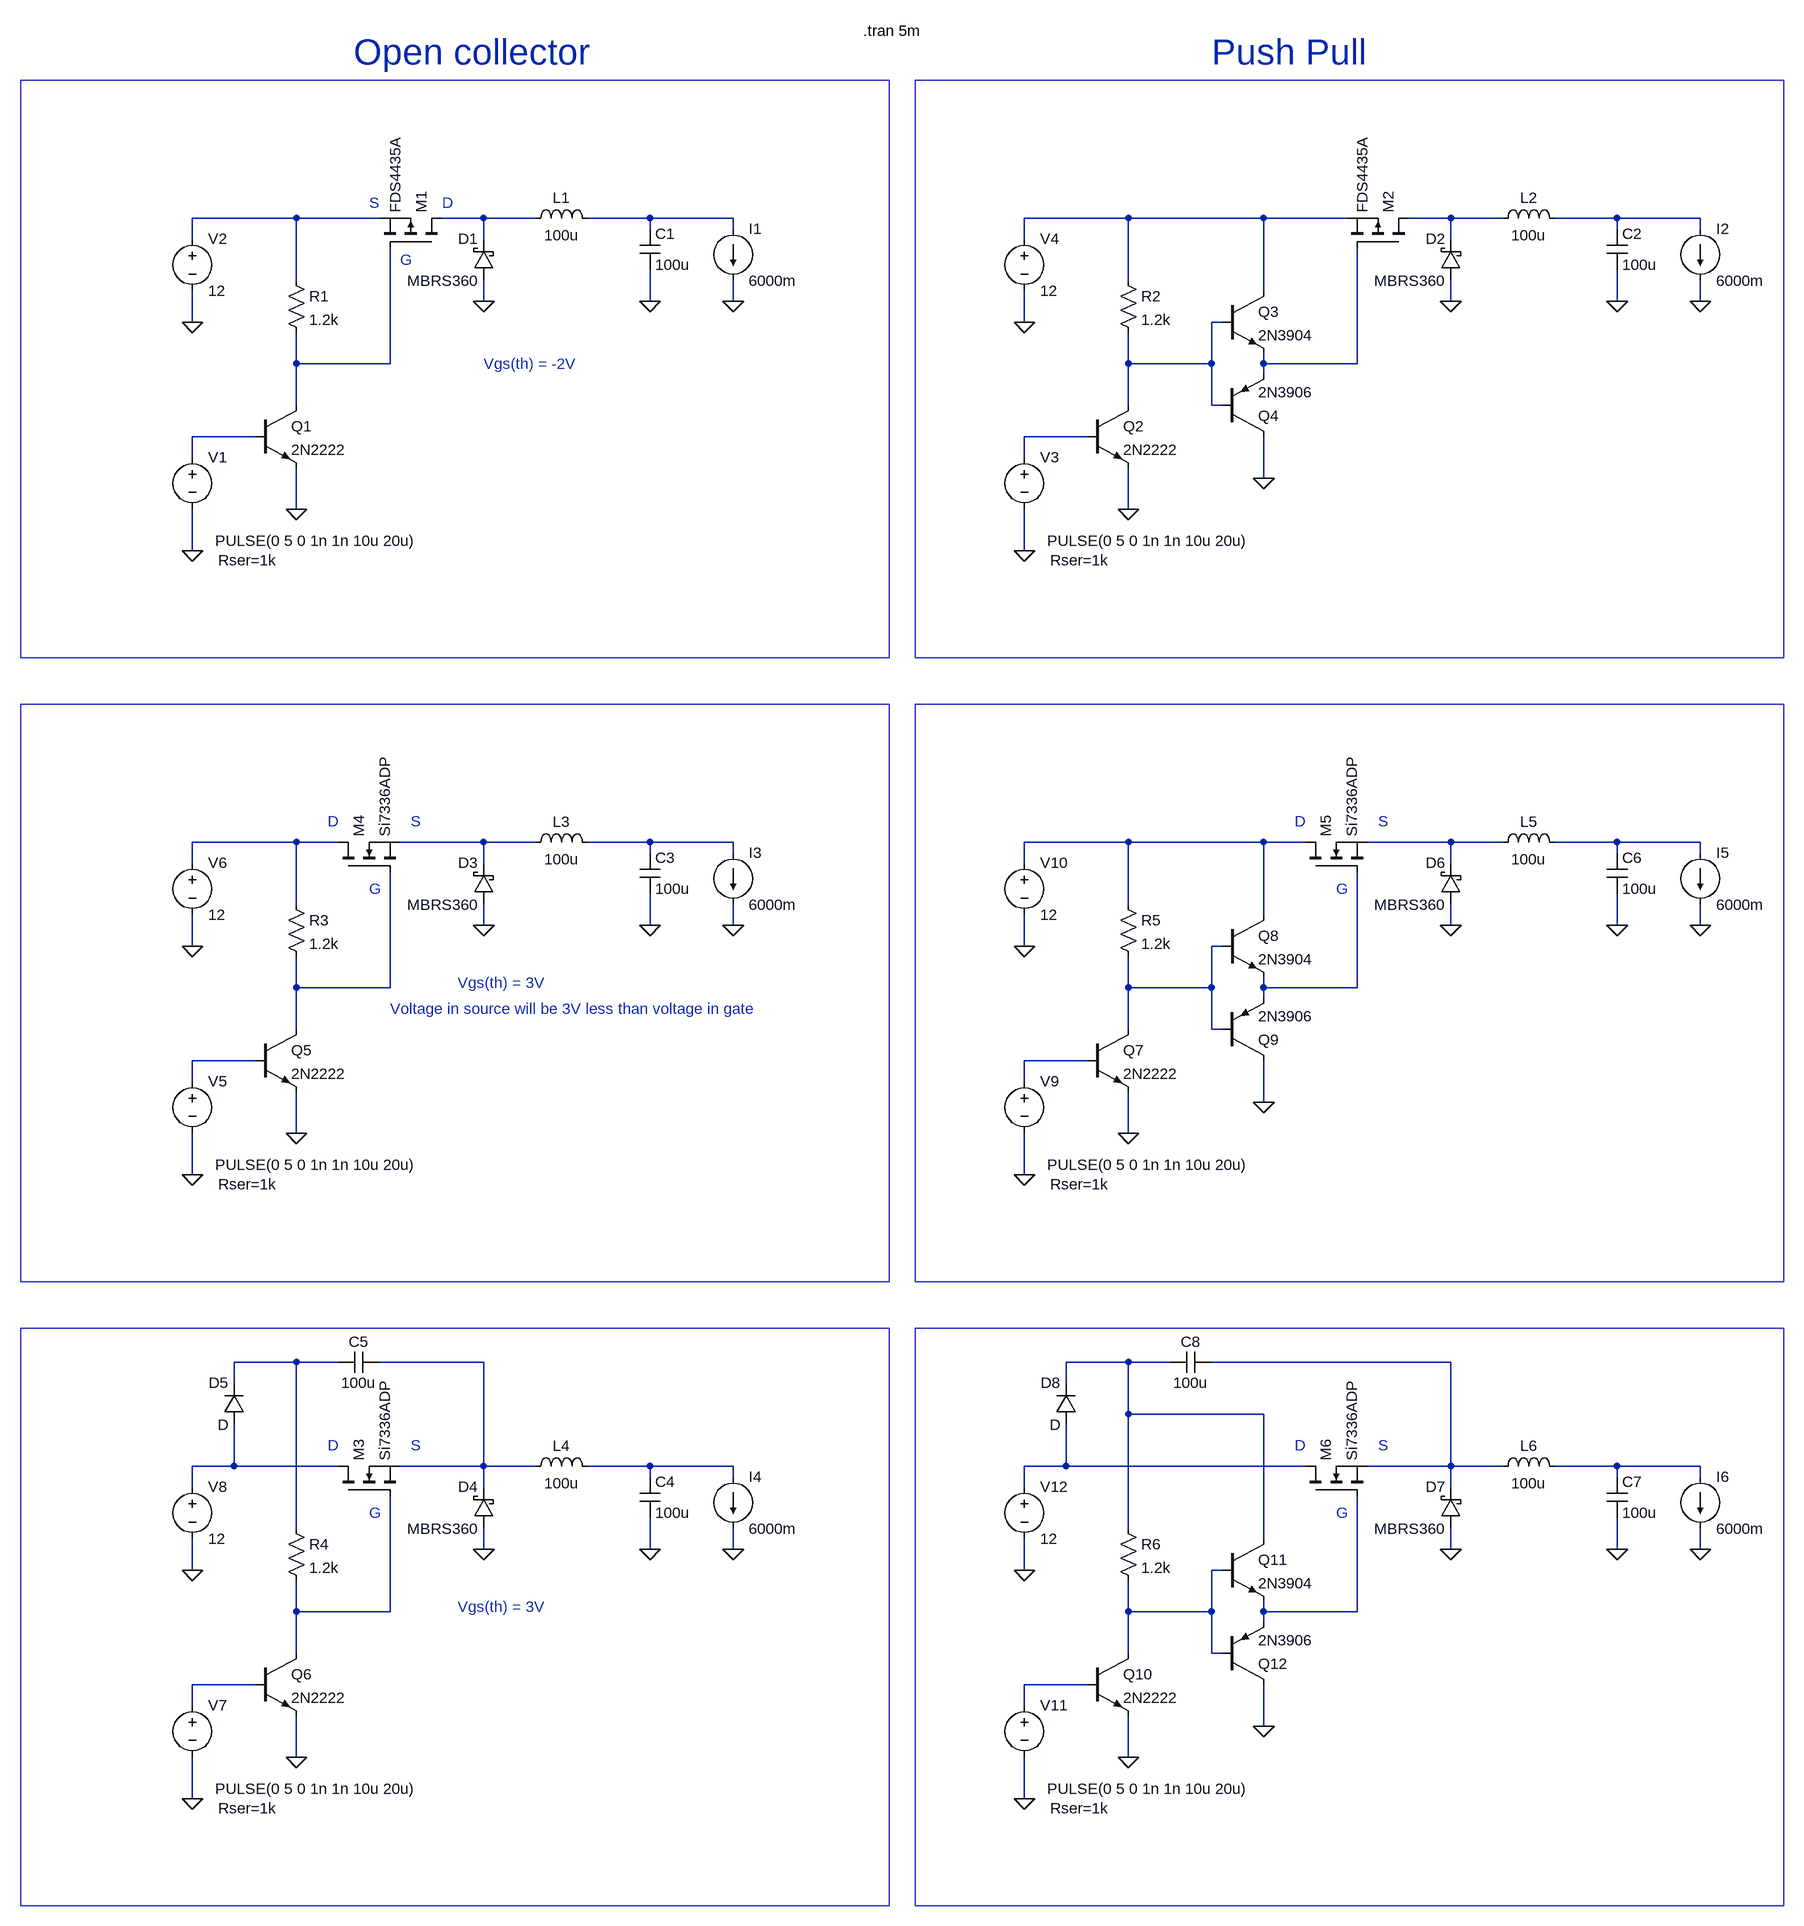
[diagram p0: schematic bulk-converters.asc]
bulk-converters.asc, the LTspice schematic file:
Version 4
SHEET 1 2732 2728
WIRE 320 128 160 128
WIRE 448 128 320 128
WIRE 608 128 544 128
WIRE 688 128 608 128
WIRE 864 128 768 128
WIRE 992 128 864 128
WIRE 1600 128 1440 128
WIRE 1808 128 1600 128
WIRE 1936 128 1808 128
WIRE 2096 128 2032 128
WIRE 2176 128 2096 128
WIRE 2352 128 2256 128
WIRE 2480 128 2352 128
WIRE 864 144 864 128
WIRE 992 144 992 128
WIRE 2352 144 2352 128
WIRE 2480 144 2480 128
WIRE 160 160 160 128
WIRE 608 160 608 128
WIRE 1440 160 1440 128
WIRE 2096 160 2096 128
WIRE 320 224 320 128
WIRE 1600 224 1600 128
WIRE 1808 240 1808 128
WIRE 608 256 608 224
WIRE 864 256 864 208
WIRE 992 256 992 224
WIRE 2096 256 2096 224
WIRE 2352 256 2352 208
WIRE 2480 256 2480 224
WIRE 160 288 160 240
WIRE 1440 288 1440 240
WIRE 1744 288 1728 288
WIRE 320 352 320 304
WIRE 464 352 464 176
WIRE 464 352 320 352
WIRE 1600 352 1600 304
WIRE 1728 352 1728 288
WIRE 1728 352 1600 352
WIRE 1808 352 1808 336
WIRE 1952 352 1952 176
WIRE 1952 352 1808 352
WIRE 1808 368 1808 352
WIRE 320 416 320 352
WIRE 1600 416 1600 352
WIRE 1728 416 1728 352
WIRE 1744 416 1728 416
WIRE 256 464 160 464
WIRE 1536 464 1440 464
WIRE 160 496 160 464
WIRE 1440 496 1440 464
WIRE 1808 528 1808 464
WIRE 320 576 320 512
WIRE 1600 576 1600 512
WIRE 160 640 160 576
WIRE 1440 640 1440 576
WIRE 320 1088 160 1088
WIRE 384 1088 320 1088
WIRE 608 1088 480 1088
WIRE 688 1088 608 1088
WIRE 864 1088 768 1088
WIRE 992 1088 864 1088
WIRE 1600 1088 1440 1088
WIRE 1808 1088 1600 1088
WIRE 1872 1088 1808 1088
WIRE 2096 1088 1968 1088
WIRE 2176 1088 2096 1088
WIRE 2352 1088 2256 1088
WIRE 2480 1088 2352 1088
WIRE 864 1104 864 1088
WIRE 992 1104 992 1088
WIRE 2352 1104 2352 1088
WIRE 2480 1104 2480 1088
WIRE 160 1120 160 1088
WIRE 608 1120 608 1088
WIRE 1440 1120 1440 1088
WIRE 2096 1120 2096 1088
WIRE 320 1184 320 1088
WIRE 1600 1184 1600 1088
WIRE 1808 1200 1808 1088
WIRE 608 1216 608 1184
WIRE 864 1216 864 1168
WIRE 992 1216 992 1184
WIRE 2096 1216 2096 1184
WIRE 2352 1216 2352 1168
WIRE 2480 1216 2480 1184
WIRE 160 1248 160 1200
WIRE 1440 1248 1440 1200
WIRE 1744 1248 1728 1248
WIRE 320 1312 320 1264
WIRE 464 1312 464 1136
WIRE 464 1312 320 1312
WIRE 1600 1312 1600 1264
WIRE 1728 1312 1728 1248
WIRE 1728 1312 1600 1312
WIRE 1808 1312 1808 1296
WIRE 1952 1312 1952 1136
WIRE 1952 1312 1808 1312
WIRE 1808 1328 1808 1312
WIRE 320 1376 320 1312
WIRE 1600 1376 1600 1312
WIRE 1728 1376 1728 1312
WIRE 1744 1376 1728 1376
WIRE 256 1424 160 1424
WIRE 1536 1424 1440 1424
WIRE 160 1456 160 1424
WIRE 1440 1456 1440 1424
WIRE 1808 1488 1808 1424
WIRE 320 1536 320 1472
WIRE 1600 1536 1600 1472
WIRE 160 1600 160 1536
WIRE 1440 1600 1440 1536
WIRE 320 1888 224 1888
WIRE 384 1888 320 1888
WIRE 608 1888 448 1888
WIRE 1600 1888 1504 1888
WIRE 1664 1888 1600 1888
WIRE 2096 1888 1728 1888
WIRE 224 1920 224 1888
WIRE 1504 1920 1504 1888
WIRE 1600 1968 1600 1888
WIRE 1808 1968 1600 1968
WIRE 224 2048 224 1984
WIRE 224 2048 160 2048
WIRE 384 2048 224 2048
WIRE 608 2048 608 1888
WIRE 608 2048 480 2048
WIRE 688 2048 608 2048
WIRE 864 2048 768 2048
WIRE 992 2048 864 2048
WIRE 1504 2048 1504 1984
WIRE 1504 2048 1440 2048
WIRE 1872 2048 1504 2048
WIRE 2096 2048 2096 1888
WIRE 2096 2048 1968 2048
WIRE 2176 2048 2096 2048
WIRE 2352 2048 2256 2048
WIRE 2480 2048 2352 2048
WIRE 864 2064 864 2048
WIRE 992 2064 992 2048
WIRE 2352 2064 2352 2048
WIRE 2480 2064 2480 2048
WIRE 160 2080 160 2048
WIRE 608 2080 608 2048
WIRE 1440 2080 1440 2048
WIRE 2096 2080 2096 2048
WIRE 320 2144 320 1888
WIRE 1600 2144 1600 1968
WIRE 1808 2160 1808 1968
WIRE 608 2176 608 2144
WIRE 864 2176 864 2128
WIRE 992 2176 992 2144
WIRE 2096 2176 2096 2144
WIRE 2352 2176 2352 2128
WIRE 2480 2176 2480 2144
WIRE 160 2208 160 2160
WIRE 1440 2208 1440 2160
WIRE 1744 2208 1728 2208
WIRE 320 2272 320 2224
WIRE 464 2272 464 2096
WIRE 464 2272 320 2272
WIRE 1600 2272 1600 2224
WIRE 1728 2272 1728 2208
WIRE 1728 2272 1600 2272
WIRE 1808 2272 1808 2256
WIRE 1952 2272 1952 2096
WIRE 1952 2272 1808 2272
WIRE 1808 2288 1808 2272
WIRE 320 2336 320 2272
WIRE 1600 2336 1600 2272
WIRE 1728 2336 1728 2272
WIRE 1744 2336 1728 2336
WIRE 256 2384 160 2384
WIRE 1536 2384 1440 2384
WIRE 160 2416 160 2384
WIRE 1440 2416 1440 2384
WIRE 1808 2448 1808 2384
WIRE 320 2496 320 2432
WIRE 1600 2496 1600 2432
WIRE 160 2560 160 2496
WIRE 1440 2560 1440 2496
FLAG 864 256 0
FLAG 992 256 0
FLAG 608 256 0
FLAG 320 576 0
FLAG 160 640 0
FLAG 160 288 0
FLAG 2352 256 0
FLAG 2480 256 0
FLAG 2096 256 0
FLAG 1808 528 0
FLAG 1440 640 0
FLAG 1440 288 0
FLAG 1600 576 0
FLAG 864 1216 0
FLAG 992 1216 0
FLAG 608 1216 0
FLAG 320 1536 0
FLAG 160 1600 0
FLAG 160 1248 0
FLAG 864 2176 0
FLAG 992 2176 0
FLAG 608 2176 0
FLAG 320 2496 0
FLAG 160 2560 0
FLAG 160 2208 0
FLAG 2352 1216 0
FLAG 2480 1216 0
FLAG 2096 1216 0
FLAG 1808 1488 0
FLAG 1440 1600 0
FLAG 1440 1248 0
FLAG 1600 1536 0
FLAG 2352 2176 0
FLAG 2480 2176 0
FLAG 2096 2176 0
FLAG 1808 2448 0
FLAG 1440 2560 0
FLAG 1440 2208 0
FLAG 1600 2496 0
SYMBOL npn 256 416 R0
SYMATTR InstName Q1
SYMATTR Value 2N2222
SYMBOL voltage 160 480 R0
WINDOW 3 35 144 Left 2
WINDOW 39 40 174 Left 2
SYMATTR Value PULSE(0 5 0 1n 1n 10u 20u)
SYMATTR SpiceLine Rser=1k
SYMATTR InstName V1
SYMBOL voltage 160 144 R0
SYMATTR InstName V2
SYMATTR Value 12
SYMBOL res 304 208 R0
SYMATTR InstName R1
SYMATTR Value 1.2k
SYMBOL pmos 544 176 M270
SYMATTR InstName M1
SYMATTR Value FDS4435A
SYMBOL ind 784 144 M270
WINDOW 0 32 56 VTop 2
WINDOW 3 5 56 VBottom 2
SYMATTR InstName L1
SYMATTR Value 100u
SYMBOL cap 848 144 R0
SYMATTR InstName C1
SYMATTR Value 100u
SYMBOL current 992 144 R0
SYMATTR InstName I1
SYMATTR Value 6000m
SYMBOL schottky 624 224 R180
WINDOW 0 24 64 Left 2
WINDOW 3 24 0 Left 2
SYMATTR InstName D1
SYMATTR Value MBRS360
SYMBOL npn 1536 416 R0
SYMATTR InstName Q2
SYMATTR Value 2N2222
SYMBOL voltage 1440 480 R0
WINDOW 3 35 144 Left 2
WINDOW 39 40 174 Left 2
SYMATTR Value PULSE(0 5 0 1n 1n 10u 20u)
SYMATTR SpiceLine Rser=1k
SYMATTR InstName V3
SYMBOL voltage 1440 144 R0
SYMATTR InstName V4
SYMATTR Value 12
SYMBOL res 1584 208 R0
SYMATTR InstName R2
SYMATTR Value 1.2k
SYMBOL pmos 2032 176 M270
SYMATTR InstName M2
SYMATTR Value FDS4435A
SYMBOL ind 2272 144 M270
WINDOW 0 32 56 VTop 2
WINDOW 3 5 56 VBottom 2
SYMATTR InstName L2
SYMATTR Value 100u
SYMBOL cap 2336 144 R0
SYMATTR InstName C2
SYMATTR Value 100u
SYMBOL current 2480 144 R0
SYMATTR InstName I2
SYMATTR Value 6000m
SYMBOL schottky 2112 224 R180
WINDOW 0 24 64 Left 2
WINDOW 3 24 0 Left 2
SYMATTR InstName D2
SYMATTR Value MBRS360
SYMBOL npn 1744 240 R0
SYMATTR InstName Q3
SYMATTR Value 2N3904
SYMBOL pnp 1744 464 M180
SYMATTR InstName Q4
SYMATTR Value 2N3906
SYMBOL npn 256 1376 R0
SYMATTR InstName Q5
SYMATTR Value 2N2222
SYMBOL voltage 160 1440 R0
WINDOW 3 35 144 Left 2
WINDOW 39 40 174 Left 2
SYMATTR Value PULSE(0 5 0 1n 1n 10u 20u)
SYMATTR SpiceLine Rser=1k
SYMATTR InstName V5
SYMBOL voltage 160 1104 R0
SYMATTR InstName V6
SYMATTR Value 12
SYMBOL res 304 1168 R0
SYMATTR InstName R3
SYMATTR Value 1.2k
SYMBOL ind 784 1104 M270
WINDOW 0 32 56 VTop 2
WINDOW 3 5 56 VBottom 2
SYMATTR InstName L3
SYMATTR Value 100u
SYMBOL cap 848 1104 R0
SYMATTR InstName C3
SYMATTR Value 100u
SYMBOL current 992 1104 R0
SYMATTR InstName I3
SYMATTR Value 6000m
SYMBOL schottky 624 1184 R180
WINDOW 0 24 64 Left 2
WINDOW 3 24 0 Left 2
SYMATTR InstName D3
SYMATTR Value MBRS360
SYMBOL nmos 384 1136 R270
SYMATTR InstName M4
SYMATTR Value Si7336ADP
SYMBOL npn 256 2336 R0
SYMATTR InstName Q6
SYMATTR Value 2N2222
SYMBOL voltage 160 2400 R0
WINDOW 3 35 144 Left 2
WINDOW 39 40 174 Left 2
SYMATTR Value PULSE(0 5 0 1n 1n 10u 20u)
SYMATTR SpiceLine Rser=1k
SYMATTR InstName V7
SYMBOL voltage 160 2064 R0
SYMATTR InstName V8
SYMATTR Value 12
SYMBOL res 304 2128 R0
SYMATTR InstName R4
SYMATTR Value 1.2k
SYMBOL ind 784 2064 M270
WINDOW 0 32 56 VTop 2
WINDOW 3 5 56 VBottom 2
SYMATTR InstName L4
SYMATTR Value 100u
SYMBOL cap 848 2064 R0
SYMATTR InstName C4
SYMATTR Value 100u
SYMBOL current 992 2064 R0
SYMATTR InstName I4
SYMATTR Value 6000m
SYMBOL schottky 624 2144 R180
WINDOW 0 24 64 Left 2
WINDOW 3 24 0 Left 2
SYMATTR InstName D4
SYMATTR Value MBRS360
SYMBOL nmos 384 2096 R270
SYMATTR InstName M3
SYMATTR Value Si7336ADP
SYMBOL diode 240 1984 R180
WINDOW 0 24 64 Left 2
WINDOW 3 24 0 Left 2
SYMATTR InstName D5
SYMBOL cap 448 1872 R90
WINDOW 0 0 32 VBottom 2
WINDOW 3 32 32 VTop 2
SYMATTR InstName C5
SYMATTR Value 100u
SYMBOL npn 1536 1376 R0
SYMATTR InstName Q7
SYMATTR Value 2N2222
SYMBOL voltage 1440 1440 R0
WINDOW 3 35 144 Left 2
WINDOW 39 40 174 Left 2
SYMATTR Value PULSE(0 5 0 1n 1n 10u 20u)
SYMATTR SpiceLine Rser=1k
SYMATTR InstName V9
SYMBOL voltage 1440 1104 R0
SYMATTR InstName V10
SYMATTR Value 12
SYMBOL res 1584 1168 R0
SYMATTR InstName R5
SYMATTR Value 1.2k
SYMBOL ind 2272 1104 M270
WINDOW 0 32 56 VTop 2
WINDOW 3 5 56 VBottom 2
SYMATTR InstName L5
SYMATTR Value 100u
SYMBOL cap 2336 1104 R0
SYMATTR InstName C6
SYMATTR Value 100u
SYMBOL current 2480 1104 R0
SYMATTR InstName I5
SYMATTR Value 6000m
SYMBOL schottky 2112 1184 R180
WINDOW 0 24 64 Left 2
WINDOW 3 24 0 Left 2
SYMATTR InstName D6
SYMATTR Value MBRS360
SYMBOL npn 1744 1200 R0
SYMATTR InstName Q8
SYMATTR Value 2N3904
SYMBOL pnp 1744 1424 M180
SYMATTR InstName Q9
SYMATTR Value 2N3906
SYMBOL nmos 1872 1136 R270
SYMATTR InstName M5
SYMATTR Value Si7336ADP
SYMBOL npn 1536 2336 R0
SYMATTR InstName Q10
SYMATTR Value 2N2222
SYMBOL voltage 1440 2400 R0
WINDOW 3 35 144 Left 2
WINDOW 39 40 174 Left 2
SYMATTR Value PULSE(0 5 0 1n 1n 10u 20u)
SYMATTR SpiceLine Rser=1k
SYMATTR InstName V11
SYMBOL voltage 1440 2064 R0
SYMATTR InstName V12
SYMATTR Value 12
SYMBOL res 1584 2128 R0
SYMATTR InstName R6
SYMATTR Value 1.2k
SYMBOL ind 2272 2064 M270
WINDOW 0 32 56 VTop 2
WINDOW 3 5 56 VBottom 2
SYMATTR InstName L6
SYMATTR Value 100u
SYMBOL cap 2336 2064 R0
SYMATTR InstName C7
SYMATTR Value 100u
SYMBOL current 2480 2064 R0
SYMATTR InstName I6
SYMATTR Value 6000m
SYMBOL schottky 2112 2144 R180
WINDOW 0 24 64 Left 2
WINDOW 3 24 0 Left 2
SYMATTR InstName D7
SYMATTR Value MBRS360
SYMBOL npn 1744 2160 R0
SYMATTR InstName Q11
SYMATTR Value 2N3904
SYMBOL pnp 1744 2384 M180
SYMATTR InstName Q12
SYMATTR Value 2N3906
SYMBOL nmos 1872 2096 R270
SYMATTR InstName M6
SYMATTR Value Si7336ADP
SYMBOL diode 1520 1984 R180
WINDOW 0 24 64 Left 2
WINDOW 3 24 0 Left 2
SYMATTR InstName D8
SYMBOL cap 1728 1872 R90
WINDOW 0 0 32 VBottom 2
WINDOW 3 32 32 VTop 2
SYMATTR InstName C8
SYMATTR Value 100u
TEXT 1192 -160 Left 2 !.tran 5m
TEXT 368 1056 Left 2 ;D
TEXT 496 1056 Left 2 ;S
TEXT 432 1160 Left 2 ;G
TEXT 568 1304 Left 2 ;Vgs(th) = 3V
TEXT 464 1344 Left 2 ;Voltage in source will be 3V less than voltage in gate
TEXT 368 2016 Left 2 ;D
TEXT 496 2016 Left 2 ;S
TEXT 432 2120 Left 2 ;G
TEXT 568 2264 Left 2 ;Vgs(th) = 3V
TEXT 1856 1056 Left 2 ;D
TEXT 1984 1056 Left 2 ;S
TEXT 1920 1160 Left 2 ;G
TEXT 1856 2016 Left 2 ;D
TEXT 1984 2016 Left 2 ;S
TEXT 1920 2120 Left 2 ;G
TEXT 608 352 Left 2 ;Vgs(th) = -2V
TEXT 480 192 Left 2 ;G
TEXT 432 104 Left 2 ;S
TEXT 544 104 Left 2 ;D
TEXT 408 -128 Left 5 ;Open collector
TEXT 1728 -128 Left 5 ;Push Pull
RECTANGLE Normal 1272 -84 2608 804
RECTANGLE Normal -104 -84 1232 804
RECTANGLE Normal -104 876 1232 1764
RECTANGLE Normal -104 1836 1232 2724
RECTANGLE Normal 1272 876 2608 1764
RECTANGLE Normal 1272 1836 2608 2724

The netlist it stands for:
* bulk-converters.asc
Q1 N008 N010 0 0 2N2222
V1 N010 0 PULSE(0 5 0 1n 1n 10u 20u) Rser=1k
V2 N001 0 12
R1 N001 N008 1.2k
M1 N002 N008 N001 N001 FDS4435A
L1 N003 N002 100u
C1 N003 0 100u
I1 N003 0 6000m
D1 0 N002 MBRS360
Q2 N007 N011 0 0 2N2222
V3 N011 0 PULSE(0 5 0 1n 1n 10u 20u) Rser=1k
V4 N004 0 12
R2 N004 N007 1.2k
M2 N005 N009 N004 N004 FDS4435A
L2 N006 N005 100u
C2 N006 0 100u
I2 N006 0 6000m
D2 0 N005 MBRS360
Q3 N004 N007 N009 0 2N3904
Q4 0 N007 N009 0 2N3906
Q5 N019 N021 0 0 2N2222
V5 N021 0 PULSE(0 5 0 1n 1n 10u 20u) Rser=1k
V6 N012 0 12
R3 N012 N019 1.2k
L3 N014 N013 100u
C3 N014 0 100u
I3 N014 0 6000m
D3 0 N013 MBRS360
M4 N012 N019 N013 N013 Si7336ADP
Q6 N032 N034 0 0 2N2222
V7 N034 0 PULSE(0 5 0 1n 1n 10u 20u) Rser=1k
V8 N027 0 12
R4 N023 N032 1.2k
L4 N028 N024 100u
C4 N028 0 100u
I4 N028 0 6000m
D4 0 N024 MBRS360
M3 N027 N032 N024 N024 Si7336ADP
D5 N027 N023 D
C5 N024 N023 100u
Q7 N018 N022 0 0 2N2222
V9 N022 0 PULSE(0 5 0 1n 1n 10u 20u) Rser=1k
V10 N015 0 12
R5 N015 N018 1.2k
L5 N017 N016 100u
C6 N017 0 100u
I5 N017 0 6000m
D6 0 N016 MBRS360
Q8 N015 N018 N020 0 2N3904
Q9 0 N018 N020 0 2N3906
M5 N015 N020 N016 N016 Si7336ADP
Q10 N031 N035 0 0 2N2222
V11 N035 0 PULSE(0 5 0 1n 1n 10u 20u) Rser=1k
V12 N029 0 12
R6 N025 N031 1.2k
L6 N030 N026 100u
C7 N030 0 100u
I6 N030 0 6000m
D7 0 N026 MBRS360
Q11 N025 N031 N033 0 2N3904
Q12 0 N031 N033 0 2N3906
M6 N029 N033 N026 N026 Si7336ADP
D8 N029 N025 D
C8 N026 N025 100u
.model D D
.lib standard.dio
.model NPN NPN
.model PNP PNP
.lib standard.bjt
.model NMOS NMOS
.model PMOS PMOS
.lib standard.mos
.tran 5m
* D
* S
* G
* Vgs(th) = 3V
* Voltage in source will be 3V less than voltage in gate
* D
* S
* G
* Vgs(th) = 3V
* D
* S
* G
* D
* S
* G
* Vgs(th) = -2V
* G
* S
* D
* Open collector
* Push Pull
.backanno
.end